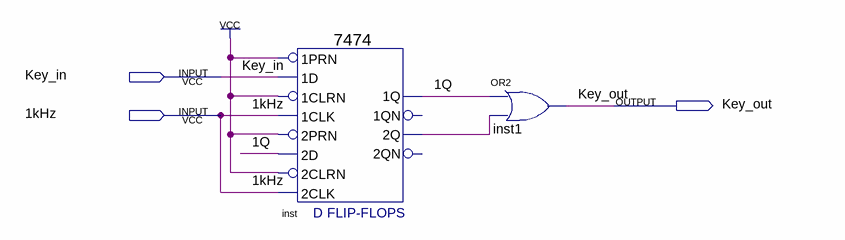
[diagram p0: schematic sheet]
// Quartus schematic Key.bdf as structural Verilog: 2 symbols, 3 pins
module Key (
  input  Key_in,
  input  \1kHz ,
  output Key_out
);

  wire \1Q , inst_2q;

  \7474  inst (
    .\2D (\1Q ), .\2PRN (1'b1), .\1CLK (\1kHz ), .\1D (Key_in), .\1PRN (1'b1), .\2CLK (\1kHz ),
    .\2CLRN (1'b1), .\1CLRN (1'b1), .\2Q (inst_2q), .\1Q (\1Q ));  // open: 1QN, 2QN
  or inst1 (Key_out, \1Q , inst_2q);
endmodule
